# Altium schematic sheet Sheet1-control.SchDoc
size A3; SheetNumber: 2; SheetTotal: 6
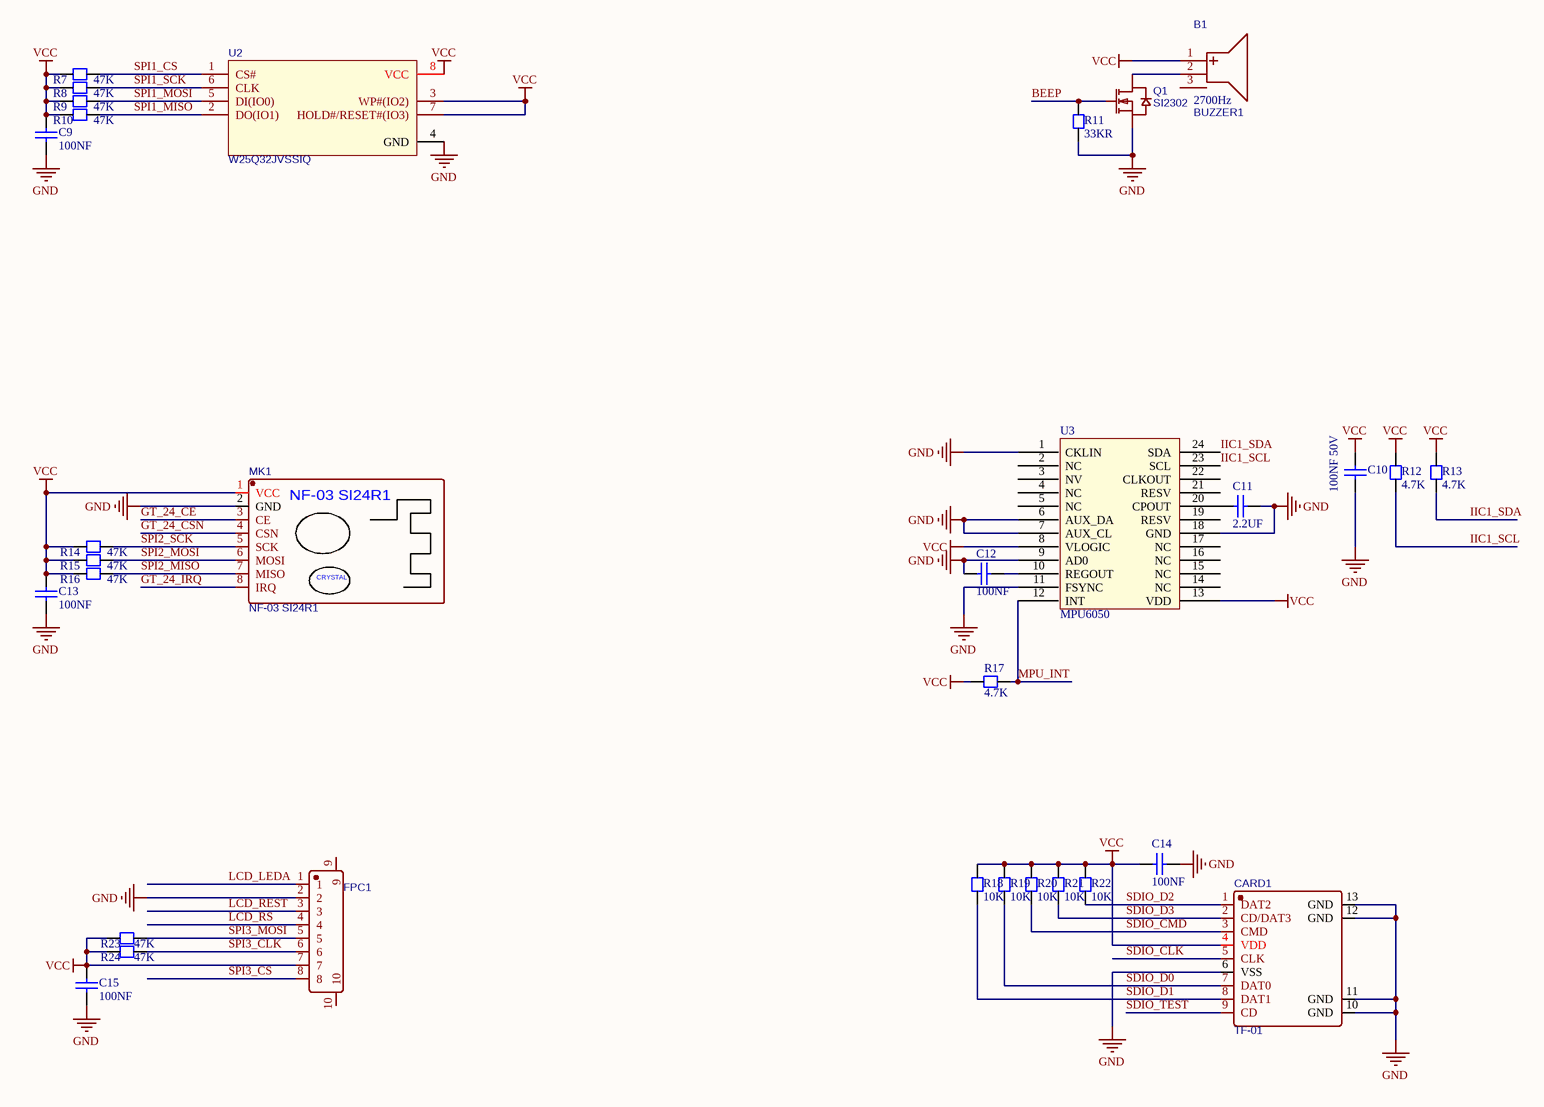
[diagram p0: Sheet1-control.SchDoc]

## Parts
B1  BUZZER1  [BUZ-SMD_GSC7525RA]
C9  100NF  [CC1608-0603]
C10  100NF 50V  [CC1608-0603]
C11  2.2UF  [CC1608-0603]
C12  100NF  [CC1608-0603]
C13  100NF  [CC1608-0603]
C14  100NF  [CC1608-0603]
C15  100NF  [CC1608-0603]
CARD1  TF-01  [TF-SMD_TF-15-15]
FPC1  FFC 05 8P  [FFC-SMD_8P-P0.50]  (value not drawn)
MK1  NF-03 SI24R1  [NF-03 SI24R1]
Q1  SI2302  [SOT-23]
R7  47K  [CR1608-0603]
R8  47K  [CR1608-0603]
R9  47K  [CR1608-0603]
R10  47K  [CR1608-0603]
R11  33KR  [CR1608-0603]
R12  4.7K  [CR1608-0603]
R13  4.7K  [CR1608-0603]
R14  47K  [CR1608-0603]
R15  47K  [CR1608-0603]
R16  47K  [CR1608-0603]
R17  4.7K  [CR1608-0603]
R18  10K  [CR1608-0603]
R19  10K  [CR1608-0603]
R20  10K  [CR1608-0603]
R21  10K  [CR1608-0603]
R22  10K  [CR1608-0603]
R23  47K  [CR1608-0603]
R24  47K  [CR1608-0603]
U2  W25Q32JVSSIQ  [SOIC-8-W25Q]
U3  MPU6050  [QFN24 - duplicate]

## Nets
GND: C9.1 C10.1 C11.2 C12.1 C13.1 C14.1 C15.1 CARD1.6(VSS) CARD1.10(GND) CARD1.11(GND) CARD1.12(GND) CARD1.13(GND) FPC1.2 MK1.2(GND) Q1.2(S) R11.2 U2.4(GND) U3.1(CKLIN) U3.6(AUX_DA) U3.7(AUX_CL) U3.9(AD0) U3.11(FSYNC) U3.18(GND)
VCC: B1.1(+) C9.2 C10.2 C13.2 C14.2 C15.2 CARD1.4(VDD) FPC1.7 MK1.1(VCC) R7.1 R8.1 R9.1 R10.1 R12.1 R13.1 R14.1 R15.1 R16.1 R17.1 R18.1 R19.1 R20.1 R21.1 R22.1 R23.2 R24.2 U2.3(WP#(IO2)) U2.7(HOLD#/RESET#(IO3)) U2.8(VCC) U3.8(VLOGIC) U3.13(VDD)
BEEP: Q1.1(G) R11.1
GT_24_CE: MK1.3(CE)
GT_24_CSN: MK1.4(CSN)
GT_24_IRQ: MK1.8(IRQ)
IIC1_SCL: R12.2 U3.23(SCL)
IIC1_SDA: R13.2 U3.24(SDA)
LCD_LEDA: FPC1.1
LCD_REST: FPC1.3
LCD_RS: FPC1.4
MPU_INT: R17.2 U3.12(INT)
SDIO_CLK: CARD1.5(CLK)
SDIO_CMD: CARD1.3(CMD) R20.2
SDIO_D0: CARD1.7(DAT0) R19.2
SDIO_D1: CARD1.8(DAT1) R18.2
SDIO_D2: CARD1.1(DAT2) R22.2
SDIO_D3: CARD1.2(CD/DAT3) R21.2
SDIO_TEST: CARD1.9(CD)
SPI1_CS: R7.2 U2.1(CS#)
SPI1_MISO: R10.2 U2.2(DO(IO1))
SPI1_MOSI: R9.2 U2.5(DI(IO0))
SPI1_SCK: R8.2 U2.6(CLK)
SPI2_MISO: MK1.7(MISO) R16.2
SPI2_MOSI: MK1.6(MOSI) R15.2
SPI2_SCK: MK1.5(SCK) R14.2
SPI3_CLK: FPC1.6 R24.1
SPI3_CS: FPC1.8
SPI3_MOSI: FPC1.5 R23.1
NetB1_2: B1.2(-) Q1.3(D)
NetC11_1: C11.1 U3.20(CPOUT)
NetC12_2: C12.2 U3.10(REGOUT)

Not connected (* = marked no-connect by the designer): B1 3(EH); FPC1 9 10; U3 2(NC) 3(NV) 4(NC) 5(NC) 14(NC) 15(NC) 16(NC) 17(NC) 19(RESV) 21(RESV) 22(CLKOUT)

## Notes on the sheet
- (in symbol NF-03 SI24R1) CRYSTAL

## Library data of the parts
B1 = BUZZER1: 2700Hz; Manufacturer: INGHAi(赢海); Manufacturer Part: GSC7525RA-16R2700; Contributor: LCSC; nameAlias: Value; Supplier: LCSC; Supplier Part: C255313; spicePre: B; spiceSymbolName: GSC7525RA-16R2700
C9-C15 = Cap Chip 0603: 0603封装的电容; Published: 8-Jun-2000; Revision: July-2002: Re-released for DXP Platform.; Publisher: Altium Limited
CARD1 = TF-01: Manufacturer: Yuandi(元迪); Contributor: LCSC; Supplier: LCSC; Supplier Part: C2889257; Manufacturer Part: TF-01; JLCPCB Part Class: Extended Part; spicePre: C; spiceSymbolName: TF-01
FPC1 = FFC 05 8P: Manufacturer: TXGA(特思嘉); Manufacturer Part: FFC05001-08SBB124W5M-H; Contributor: LCSC; Supplier: LCSC; Supplier Part: C456420; JLCPCB Part Class: Extended Part; spicePre: F; spiceSymbolName: FFC05001-08SBB124W5M-H
MK1 = NF-03 SI24R1: Manufacturer: Ashining(泽耀科技); Manufacturer Part: AS01-ML01S; Supplier: LCSC; Supplier Part: C84802; JLCPCB Part Class: Extended Part; spicePre: M; spiceSymbolName: AS01-ML01S
Q1 = SI2302: N沟道 / 漏源电压(Vdss) 20V / 连续漏极电流(Id) 2.8A / 功率(Pd) 900mW / 导通电阻(RDS(on)@Vgs,Id) 55mΩ@4.5V,2.8A / 阈值电压(Vgs(th)@Id) 1.2V@250uA / 输入电容(Ciss@Vds) 260pF@10V; Manufacturer: TWGMC(台湾迪嘉); Manufacturer Part: SI2306; Contributor: LCSC; Supplier: LCSC; Supplier Part: C727154; JLCPCB Part Class: Extended Part; spicePre: Q; spiceSymbolName: SI2306_C727154
R7-R11 = Chip resistor: 贴片电阻
R12-R24 = Resistor Chip 0603: 0603封装电阻; Published: 8-Jun-2000; Revision: July-2002: Re-released for DXP Platform.; Publisher: Altium Limited
U2 = W25Q32JVSSIQ: Manufacturer: WINBOND(华邦); Manufacturer Part: W25Q128JVPIQ; Contributor: LCSC; Supplier: LCSC; Supplier Part: C2803379; JLCPCB Part Class: Extended Part; spicePre: U; spiceSymbolName: W25Q128JVPIQ
U3 = MPU6050: 陀螺仪